# EAGLE design RTU (EAGLE 6.4)
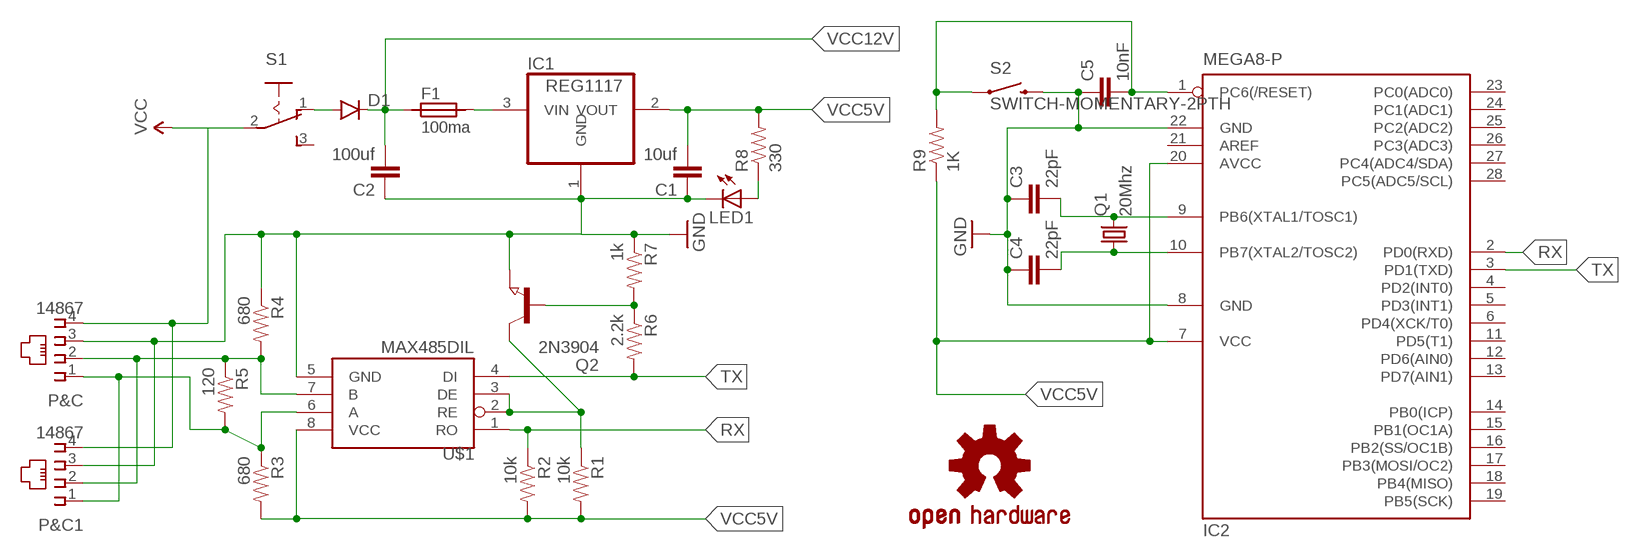
[diagram p0: schematic, sheet 1]

## Parts
C1  10uf  CAP0805  [0805]
C2  100uf  CAP0805  [0805]
C3  22pF  CAP0805  [0805]
C4  22pF  CAP0805  [0805]
C5  10nF  CAP0805  [0805]
D1  DIODESMA  [SMA-DIODE]
F1  100ma  SIBA194600  [1820]
IC1  REG1117  [SOT223]
IC2  MEGA8-P  [DIL28-3]
LED1  LEDCHIP-LED0805  [CHIP-LED0805]
LOGO1  OSHW-LOGOL  [OSHW-LOGO-L]
P&C  14867  [14867]
P&C1  14867  [14867]
Q1  20Mhz  CRYSTALSM49  [SM49]
Q2  2N3904  NPN-TRANSISTOR_SOT23  [SOT23]
R1  10k  RESISTOR0805-RES  [0805]
R2  10k  RESISTOR0805-RES  [0805]
R3  680  RESISTOR0805-RES  [0805]
R4  680  RESISTOR0805-RES  [0805]
R5  120  RESISTOR0805-RES  [0805]
R6  2.2k  RESISTOR0805-RES  [0805]
R7  1k  RESISTOR0805-RES  [0805]
R8  330  RESISTOR0805-RES  [0805]
R9  1K  RESISTOR0805-RES  [0805]
S1  255SB  [255SB]
S2  SWITCH-MOMENTARY-2PTH  [TACTILE-PTH]
U$1  MAX485DIL  [DIL08]

## Nets
GND: C1.1 C2.1 C3.1 C4.1 C5.1 IC1.1(GND) IC2.8(GND) IC2.22(GND) LED1.C P&C1.3 P&C.3 Q2.2(E) R4.1 R7.1 S2.3 U$1.5(GND)
N$2: Q2.3(C) R1.1 U$1.2(RE) U$1.3(DE)
N$4: Q2.1(B) R6.1 R7.2
N$7: P&C1.2 P&C.2 R4.2 R5.1 U$1.7(B)
N$8: P&C1.1 P&C.1 R3.1 R5.2 U$1.6(A)
N$9: F1.2 IC1.3(VIN)
N$11: LED1.A R8.1
N$13: D1.A S1.1(O)
N$21: C3.2 IC2.9(PB6(XTAL1/TOSC1)) Q1.2
N$23: C4.2 IC2.10(PB7(XTAL2/TOSC2)) Q1.1
N$24: C5.2 IC2.1(PC6(/RESET)) R9.2 S2.1
RX: IC2.2(PD0(RXD)) R2.1 U$1.1(RO)
TX: IC2.3(PD1(TXD)) R6.2 U$1.4(DI)
VCC: P&C1.4 P&C.4 S1.2(P)
VCC5V: C1.2 IC1.2(VOUT) IC2.7(VCC) IC2.20(AVCC) R1.2 R2.2 R3.2 R8.2 R9.1 U$1.8(VCC)
VCC12V: C2.2 D1.C F1.1
Unconnected: IC2.4(PD2(INT0)) IC2.5(PD3(INT1)) IC2.6(PD4(XCK/T0)) IC2.11(PD5(T1)) IC2.12(PD6(AIN0)) IC2.13(PD7(AIN1)) IC2.14(PB0(ICP)) IC2.15(PB1(OC1A)) IC2.16(PB2(SS/OC1B)) IC2.17(PB3(MOSI/OC2)) IC2.18(PB4(MISO)) IC2.19(PB5(SCK)) IC2.21(AREF) IC2.23(PC0(ADC0)) IC2.24(PC1(ADC1)) IC2.25(PC2(ADC2)) IC2.26(PC3(ADC3)) IC2.27(PC4(ADC4/SDA)) IC2.28(PC5(ADC5/SCL)) S1.3(S)

## Library data of the parts
C1-C5 = SparkFun-Capacitors:CAP: Capacitor Standard 0603 ceramic capacitor, and 0.1" leaded capacitor.
D1 = SparkFun-DiscreteSemi:DIODE: Diode These are standard reverse protection diodes and small signal diodes. SMA package can handle up to about 1A. SOD-323 can handle about 200mA. What the SOD-323 package when ordering, there are some mfgs out there that are 5-pin packages.
F1 = _hhn_PtcFuses_Siba_r500_Ozan:SIBA194600*: SIBA PTC-Fuses, Series 194600, 1812 (4.5 3.2)mm Source: www.siba.de/ Package: SMD 1812 (4.5 x 3.2)mm Technologies: SIBA194600Axxx xxx: Trip-Current * 10 mA Author: Dipl.-Ing. FH Rainer Bayer
IC1 = burr-brown:REG1117: 800mA and 1A Low Dropout (LDO) Positive Regulator 1.8V, 2.5V, 2.85V, 3.3V, 5V, and Adj; MPN: REG1117; OC_FARNELL: 1097566; OC_NEWARK: 14P6981
IC2 = atmel:MEGA8-P: MICROCONTROLLER 8 Kbytes FLASH, 1 kbytes SRAM, 512 bytes EEPROM, USART, 4-channel 10 bit ADC, 2-channel 8 bit ADC Pin compatible with Atmega48, ATMega88, ATMega168 Source: avr.lbr; OC_FARNELL: unknown; OC_NEWARK: unknown
LED1 = led:LED: LED OSRAM: - CHIPLED LG R971, LG N971, LY N971, LG Q971, LY Q971, LO R971, LY R971 LH N974, LH R974 LS Q976, LO Q976, LY Q976 LO Q996 - Hyper CHIPLED LW Q18S LB Q993, LB Q99A, LB R99A - SideLED LS A670, LO A670, LY A670, LG A670, LP A670 LB A673, LV A673, LT A673, LW A673 LH A674 LY A675 LS A676, LA A676, LO A676, LY A676, LW A676 LS A679, LY A679, LG A679 - Hyper Micro SIDELED® LS Y876, LA Y876, LO Y876, LY Y876 LT Y87S - SmartLED LW L88C, LW L88S LB L89C, LB L89S, LG L890 LS L89K, LO L89K, LY L89K LS L896, LA L896, LO L896, LY L896 - TOPLED LS T670, LO T670, LY T670, LG T670, LP T670 LSG T670, LSP T670, LSY T670, LOP T670, LYG T670 LG T671, LOG T671, LSG T671 LB T673, LV T673, LT T673, LW T673 LH T674 LS T676, LA T676, LO T676, LY T676, LB T676, LH T676, LSB T676, LW T676 LB T67C, LV T67C, LT T67C, LS T67K, LO T67K, LY T67K, LW E67C LS E67B, LA E67B, LO E67B, LY E67B, LB E67C, LV E67C, LT E67C LW T67C LS T679, LY T679, LG T679 LS T770, LO T770, LY T770, LG T770, LP T770 LB T773, LV T773, LT T773, LW T773 LH T774 LS E675, LA E675, LY E675, LS T675 LS T776, LA T776, LO T776, LY T776, LB T776 LHGB T686 LT T68C, LB T68C - Hyper Mini TOPLED® LB M676 - Mini TOPLED Santana® LG M470 LS M47K, LO M47K, LY M47K Source: http://www.osram.convergy.de LUXEON: - LUMILED® LXK2-PW12-R00, LXK2-PW12-S00, LXK2-PW14-U00, LXK2-PW14-V00 LXK2-PM12-R00, LXK2-PM12-S00, LXK2-PM14-U00 LXK2-PE12-Q00, LXK2-PE12-R00, LXK2-PE12-S00, LXK2-PE14-T00, LXK2-PE14-U00 LXK2-PB12-K00, LXK2-PB12-L00, LXK2-PB12-M00, LXK2-PB14-N00, LXK2-PB14-P00, LXK2-PB14-Q00 LXK2-PR12-L00, LXK2-PR12-M00, LXK2-PR14-Q00, LXK2-PR14-R00 LXK2-PD12-Q00, LXK2-PD12-R00, LXK2-PD12-S00 LXK2-PH12-R00, LXK2-PH12-S00 LXK2-PL12-P00, LXK2-PL12-Q00, LXK2-PL12-R00 Source: www.luxeon.com KINGBRIGHT: KA-3528ASYC Source: www.kingbright.com
LOGO1 = SparkFun-Aesthetics:OSHW-LOGO: Open Source Hardware Logo This logo indicates the piece of hardware it is found on incorporates a OSHW license and/or adheres to the definition of open source hardware found here: http://freedomdefined.org/OSHW
P&C P&C1 = con-4ucon:14867: RJ11 Connector Source: 4UCON TECHNOLOGY INC. 14867.pdf; OC_FARNELL: unknown; OC_NEWARK: unknown
Q1 = crystal:CRYSTAL: CRYSTAL; OC_FARNELL: unknown; OC_NEWARK: unknown
Q2 = semicon-smd-ipc:NPN-TRANSISTOR_: NPN TRANSISTOR
R1-R9 = SparkFun-Passives:RESISTOR: Resistor Basic schematic elements and footprints for 0603, 1206, and PTH resistors.
S1 = switch:255SB: SLIDING SWITCH Distributor Buerklin, 11G810
S2 = SparkFun-Electromechanical:SWITCH-MOMENTARY-2: Various NO switches- pushbuttons, reed, etc
U$1 = SparkFun-DigitalIC:MAX485: RS-485 transceiver

## Net classes
0 default: width 0.3 mm, drill 0.5 mm, clearance 0.25 mm

## Board
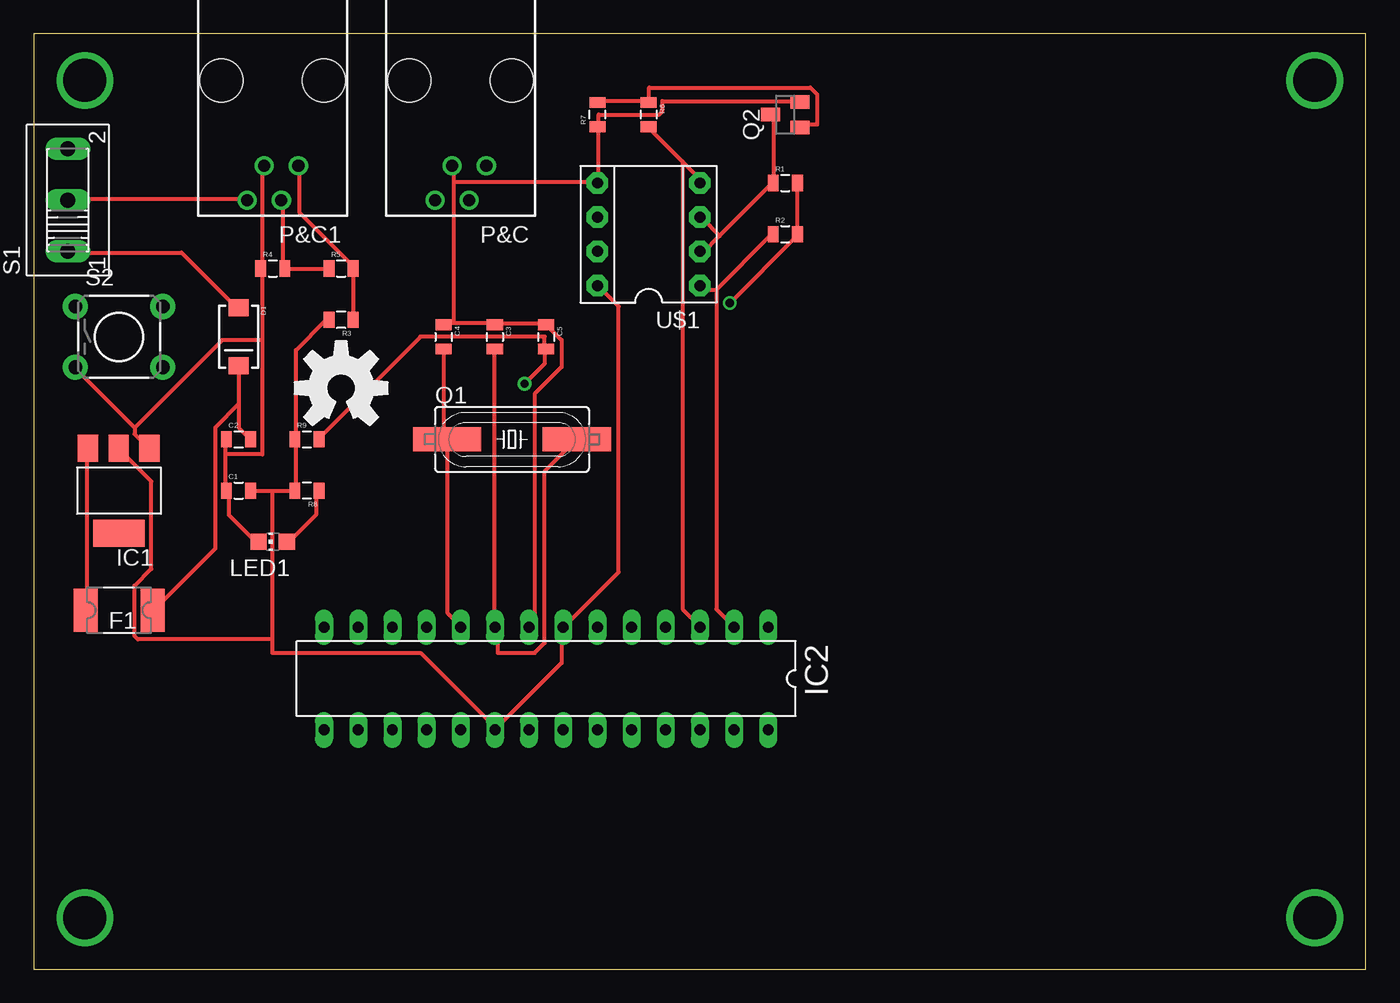
[diagram p1: board, top side]
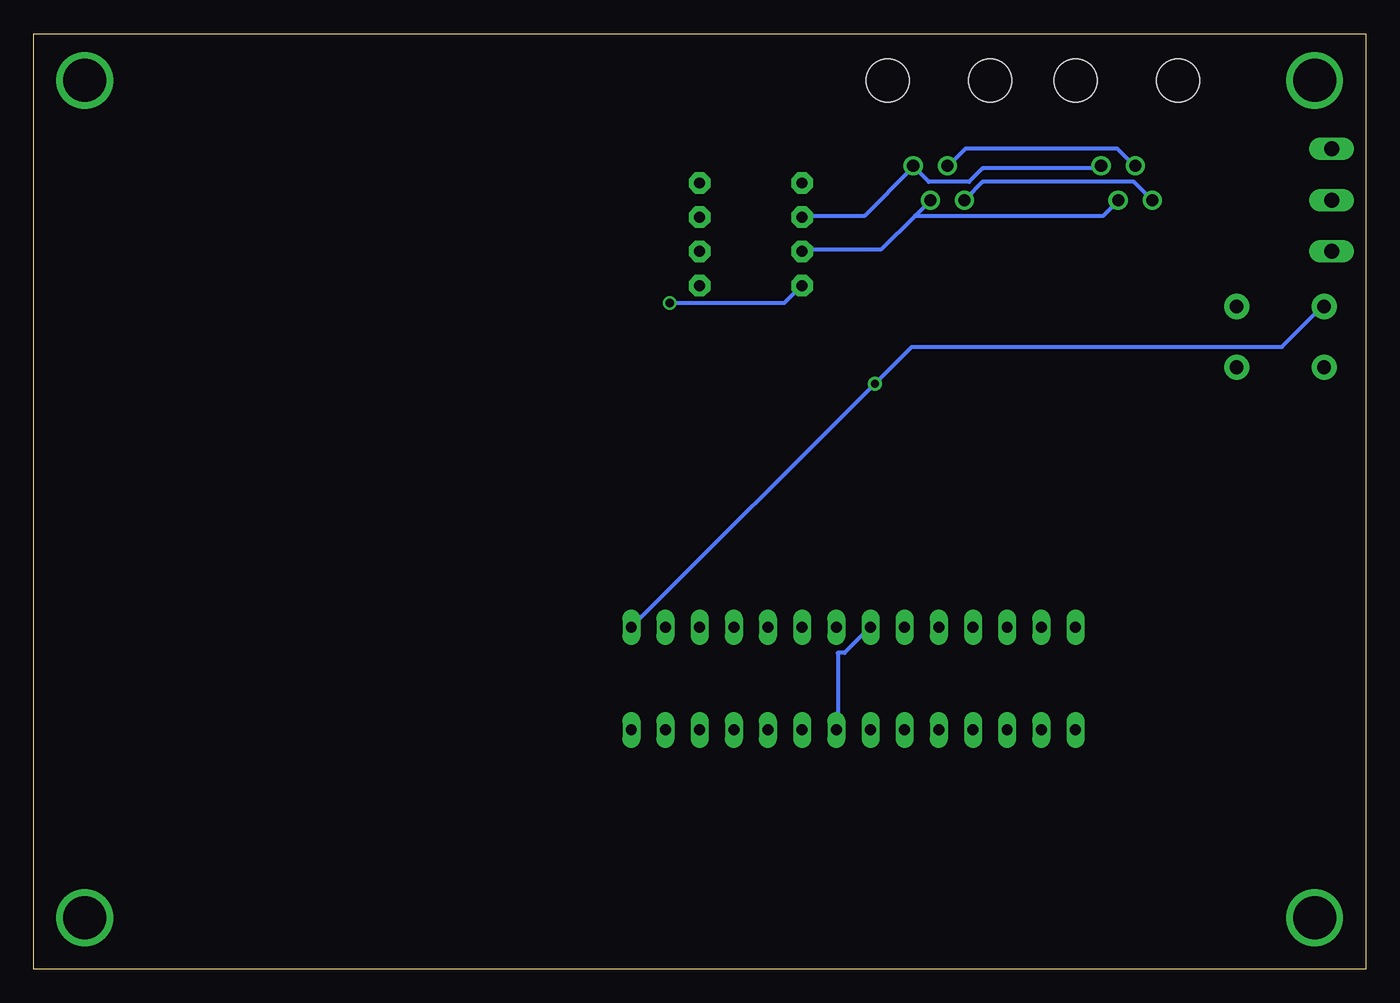
[diagram p2: board, bottom side, seen from below]

Size 99.04 x 69.52 mm. Coordinates in mm from the lower left corner, seen from the top.
Outline: 0,0 99.04,0 99.04,69.52 0,69.52 0,0
Copper layers (1*16): Top 0.035mm / dielectric 1.5mm / Bottom 0.035mm
Design rules "default": minimum track width 10mil, minimum drill 24mil, track to track 8mil, track to pad 8mil, pad to pad 8mil, via to via 8mil, smd to smd 8mil, copper to edge 40mil, drill to drill 8mil, minimum pad ring 10mil, minimum via ring 8mil, stop-mask expansion 4mil, vias tented up to drill 0mil, thermal gap 10mil

### Footprints (pad centres in the part's own frame; a part is rotated, then mirrored left to right if it is on the bottom)
0805 = smd 0.8 x 1.2: 1 -0.9,0; 2 0.9,0
SMA-DIODE = smd 1.27 x 1.47: A -2.15,0; C 2.15,0
1820 = smd 1.78 x 3.2: 1 -2.49,0; 2 2.49,0
SOT223 = smd 1.499 x 2.007: 1 -2.261,-3.15; 2 0.025,-3.15; 3 2.311,-3.15 | smd 3.81 x 2.007: 4 0,3.15
DIL28-3 = drill 0.813 long: 1 -16.51,-3.81; 2 -13.97,-3.81; 3 -11.43,-3.81; 4 -8.89,-3.81; 5 -6.35,-3.81; 6 -3.81,-3.81; 7 -1.27,-3.81; 8 1.27,-3.81; 9 3.81,-3.81; 10 6.35,-3.81; 11 8.89,-3.81; 12 11.43,-3.81; 13 13.97,-3.81; 14 16.51,-3.81; 15 16.51,3.81; 16 13.97,3.81; 17 11.43,3.81; 18 8.89,3.81; 19 6.35,3.81; 20 3.81,3.81; 21 1.27,3.81; 22 -1.27,3.81; 23 -3.81,3.81; 24 -6.35,3.81; 25 -8.89,3.81; 26 -11.43,3.81; 27 -13.97,3.81; 28 -16.51,3.81
CHIP-LED0805 = smd 1.2 x 1.2: A 0,-1.05; C 0,1.05
14867 = drill 0.9 pad 1.422: 1 -1.905,6.35; 2 -0.635,8.89; 3 0.635,6.35; 4 1.905,8.89 | hole 3.2: -3.81,0; 3.81,0
SM49 = smd 5.08 x 1.778: 1 -4.826,0; 2 4.826,0
SOT23 = smd 1 x 1.4: 1 -0.95,-1.1; 2 0.95,-1.1; 3 0,1.1
255SB = drill 1.118 long: 1 -3.81,0; 2 0,0; 3 3.81,0
TACTILE-PTH = drill 1.016 pad 1.88: 1 -3.251,2.261; 2 3.251,2.261; 3 -3.251,-2.261; 4 3.251,-2.261
DIL08 = drill 0.813 pad 1.6 octagon: 1 -3.81,-3.81; 2 -1.27,-3.81; 3 1.27,-3.81; 4 3.81,-3.81; 5 3.81,3.81; 6 1.27,3.81; 7 -1.27,3.81; 8 -3.81,3.81

### Placement (x,y rotation side)
C1  15.24,35.56 0 top
C2  15.24,39.37 0 top
C3  34.29,46.99 270 top
C4  30.48,46.99 270 top
C5  38.1,46.99 270 top
D1  15.24,46.99 270 top
F1  6.35,26.67 180 top
IC1  6.35,35.56 180 top
IC2  38.1,21.59 180 top
LED1  17.78,31.75 90 top
LOGO1  22.86,43.18 0 top
P&C  31.75,66.04 180 top
P&C1  17.78,66.04 180 top
Q1  35.56,39.37 0 top
Q2  55.88,63.5 90 top
R1  55.88,58.42 0 top
R2  55.88,54.61 0 top
R3  22.86,48.26 180 top
R4  17.78,52.07 0 top
R5  22.86,52.07 0 top
R6  45.72,63.5 270 top
R7  41.91,63.5 90 top
R8  20.32,35.56 180 top
R9  20.32,39.37 0 top
S1  2.54,57.15 90 top
S2  6.35,46.99 0 top
U$1  45.72,54.61 90 top

### Tracks (layer width: path | path; a pad name or v marks a point on that pad's centre or on a via)
GND
  Top 0.3: 8.75,38.75 IC1.1 8.5,38.75 7.5,39.75 7.5,40.25 | 7.5,40.25 3.25,44.5 S2.3 | 14.25,38.25 14.25,39.25 C2.1 | 14.25,38.25 14.25,35.75 C1.1 14.5,35.5 14.5,33.75 16.5,31.75 LED1.C | P&C1.3 17,59.5 17,52.25 R4.1 17,52 17,46.75 | 14.25,38.25 17,38.25 17,46.75 | 7.5,40.25 14,46.75 17,46.75 | Q2.2 56.75,64.5 46.75,64.5 46.75,63.75 46.5,63.5 42,63.5 42,62.75 R7.1 42,62.5 42,58.5 U$1.5 41.75,58.5 31.25,58.5 | 31.25,48 34.25,48 C3.1 34.5,48 38,48 C5.1 38.25,47.75 39.25,46.75 39.25,44.75 37.25,42.75 37.25,25.75 37,25.5 IC2.8 | 31.25,48 30.5,48 C4.1 | 31.25,48 31.25,58.5 | 31.25,58.5 31.25,59.5 P&C.3
  Bottom 0.3: IC2.22 39.25,18 39.25,23.5 38.75,23.5 37,25.25 IC2.8 | P&C1.3 17.25,59.75 18.5,61 29.75,61 31,59.75 P&C.3
N$1  (via drill 3.2)
  other vias: 3.81,66.04
N$2
  Top 0.3: Q2.3 55,63.5 55,58.5 R1.1 54.75,58.25 51,54.5 | 51,54.5 49.75,53.25 U$1.2 | 51,54.5 49.75,55.75 U$1.3
N$3  (via drill 3.2)
  other vias: 3.81,3.81
N$4
  Top 0.3: R7.2 42,64.5 45.5,64.5 R6.1 45.75,64.5 45.75,65.5 57.75,65.5 58.25,65 58.25,62.75 57,62.75 Q2.1
N$5  (via drill 3.2)
  other vias: 95.25,66.04
N$6  (via drill 3.2)
  other vias: 95.25,3.81
N$7
  Top 0.3: R5.1 21.75,52 18.75,52 R4.2 18.5,52.25 18.5,57 P&C1.2
  Bottom 0.3: 33.5,56 36,53.5 41.75,53.5 U$1.7 | 33.5,56 32.5,57 P&C.2 | 33.5,56 19.5,56 18.5,57 P&C1.2
N$8
  Top 0.3: R3.1 23.75,48.5 23.75,52 R5.2 23.75,52.25 19.75,56.25 19.75,59.5 P&C1.1
  Bottom 0.3: U$1.6 41.75,56 37.25,56 33.75,59.5 P&C.1 33.5,59.5 32.5,58.5 29.5,58.5 28.5,59.5 19.75,59.5 P&C1.1
N$9
  Top 0.3: IC1.3 4,38.5 4,26.75 F1.2
N$11
  Top 0.3: LED1.A 19,31.75 21,33.75 21,35.5 R8.1
N$13
  Top 0.3: D1.A 15,49.25 11,53.25 2.75,53.25 S1.1
N$21
  Top 0.3: C3.2 34.25,46 34.25,25.5 IC2.9 34.5,25.25 34.5,23.5 37.25,23.5 38,24.25 38,37 40.25,39.25 Q1.2
N$23
  Top 0.3: C4.2 30.5,46 30.5,39.5 Q1.1 30.75,39.25 30.75,26.5 31.75,25.5 IC2.10
N$24  (via drill 0.61)
  Top 0.3: R9.2 21.25,39.5 28.75,47 38,47 38,46.25 C5.2 38,46 38,45 v36.5,43.5
  Bottom 0.3: IC2.1 54.5,25.5 v36.5,43.5 33.75,46.25 6.25,46.25 3.25,49.25 S2.1
RX
  Top 0.3: 50.75,50.5 54.75,54.5 R2.1 | 50.75,50.5 49.75,50.5 49.75,50.75 U$1.1 | 50.75,50.5 50.75,26.75 52,25.5 IC2.2
TX
  Top 0.3: 48.25,60 49.5,58.75 49.5,58.5 U$1.4 | 48.25,60 45.75,62.5 R6.2 | 48.25,60 48.25,26.75 49.5,25.5 IC2.3
VCC
  Top 0.3: P&C1.4 15.75,57.25 2.75,57.25 S1.2
  Bottom 0.3: P&C.4 29.75,57.25 28.5,58.5 17.25,58.5 16,57.25 P&C1.4
VCC5V  (via drill 0.61)
  Top 0.3: R1.2 56.75,58.25 56.75,54.75 R2.2 56.75,54.5 v51.75,49.5 | 17.75,35.5 19.25,35.5 R8.2 19.5,35.75 19.5,39.25 R9.1 19.5,39.5 19.5,46 21.75,48.25 R3.2 | 17.75,35.5 16.25,35.5 C1.2 | 17.75,24.5 7.75,24.5 7.5,24.75 7.5,28.5 8.75,29.75 8.75,36.25 6.5,38.5 IC1.2 | 17.75,35.5 17.75,24.5 | 17.75,24.5 17.75,23.5 28.75,23.5 34.25,18 IC2.20 34.5,18 39.25,22.75 39.25,25.25 IC2.7 39.5,25.5 43.5,29.5 43.5,49.25 42,50.75 U$1.8
  Bottom 0.3: v51.75,49.5 43.25,49.5 42,50.75 U$1.8
VCC12V
  Top 0.3: 15.25,42 15.25,44.75 D1.C | 15.25,42 15.25,40.25 16,39.5 C2.2 | 15.25,42 13.5,40.25 13.5,31.25 9,26.75 F1.1